# EAGLE design Gripper Control Board (EAGLE 9.6.2)
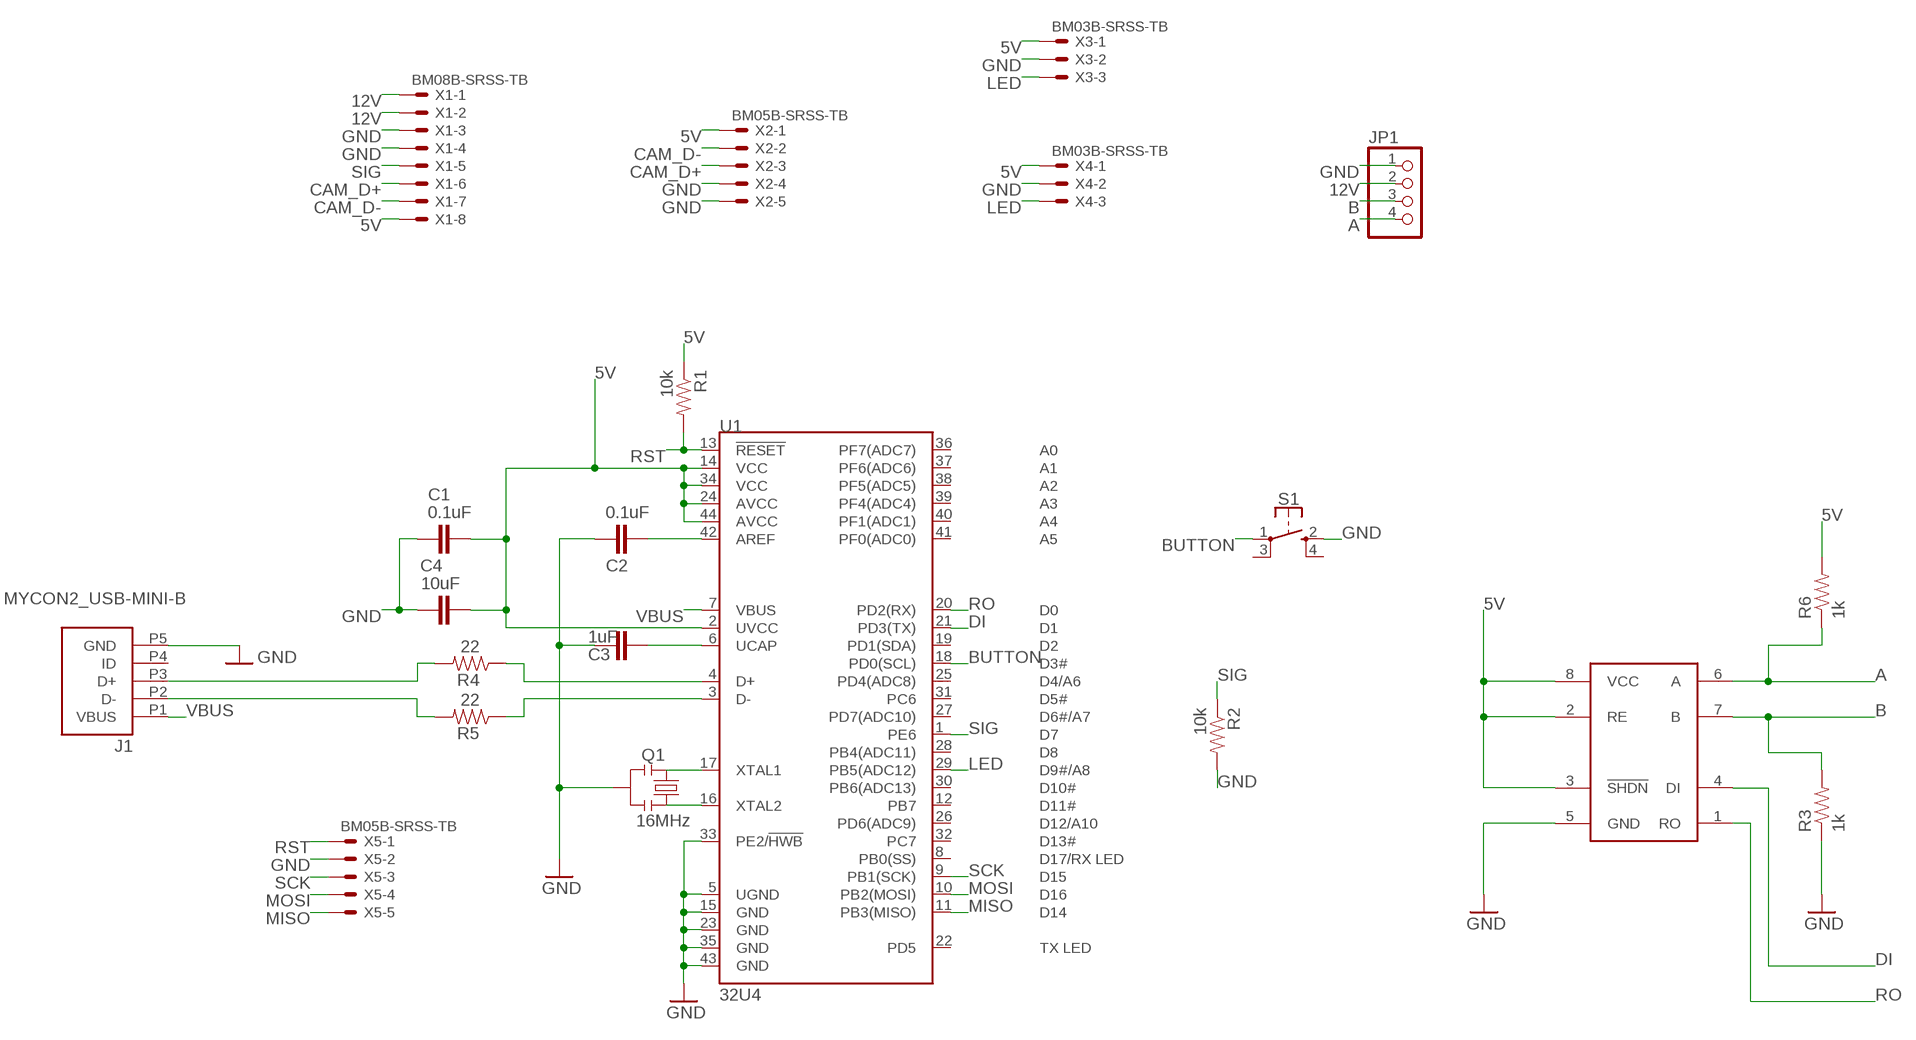
[diagram p0: schematic, sheet 1]

## Parts
C1  0.1uF  CAP0603-CAP  [0603-CAP]
C2  0.1uF  CAP0603-CAP  [0603-CAP]
C3  1uF  CAP0603-CAP  [0603-CAP]
C4  10uF  CAP0805  [0805]
J1  MYCON2_USB-MINI-B  [CON2_USB_MICRO_B_AT]
JP1  PINHD-1X4  [1X04]
Q1  16MHz  RESONATORSMD  [RESONATOR-SMD]
R1  10k  RESISTOR0603  [0603-RES]
R2  10k  RESISTOR0603  [0603-RES]
R3  1k  RESISTOR0603-RES  [0603-RES]
R4  22  RESISTOR0603  [0603-RES]
R5  22  RESISTOR0603  [0603-RES]
R6  1k  RESISTOR0603-RES  [0603-RES]
S1  SKSGAAE010  [SKSG]
U1  32U4  ATMEGA32U4QFN2  [QFN-44-NOPAD]
U2  MAX13487  MAX13487SOIC  [MAX13487]
X1  BM08B-SRSS-TB  [BM08B-SRSS-TB]
X2  BM05B-SRSS-TB  [BM05B-SRSS-TB]
X3  BM03B-SRSS-TB  [BM03B-SRSS-TB]
X4  BM03B-SRSS-TB  [BM03B-SRSS-TB]
X5  BM05B-SRSS-TB  [BM05B-SRSS-TB]

## Nets
5V [POWER]: C1.2 C4.2 R1.1 R6.2 U1.2(UVCC) U1.14(VCC) U1.24(AVCC) U1.34(VCC) U1.44(AVCC) U2.2(RE) U2.3(!SHDN) U2.8(VCC) X1.8 X2.1 X3.1 X4.1
12V [POWER]: JP1.2 X1.1 X1.2
A: JP1.4 R6.1 U2.6(A)
B: JP1.3 R3.2 U2.7(B)
BUTTON: S1.1 U1.18(PD0(SCL))
CAM_D+: X1.6 X2.3
CAM_D-: X1.7 X2.2
DI: U1.21(PD3(TX)) U2.4(DI)
GND: C1.1 C2.1 C3.1 C4.1 J1.P5(GND) JP1.1 Q1.2 R2.2 R3.1 S1.2 U1.5(UGND) U1.15(GND) U1.23(GND) U1.33(PE2/!HWB) U1.35(GND) U1.43(GND) U2.5(GND) X1.3 X1.4 X2.4 X2.5 X3.2 X4.2 X5.2
LED: U1.29(PB5(ADC12)) X3.3 X4.3
MISO: U1.11(PB3(MISO)) X5.5
MOSI: U1.10(PB2(MOSI)) X5.4
N$36: R4.1 U1.4(D+)
N$37: C3.2 U1.6(UCAP)
N$38: R5.1 U1.3(D-)
N$39: C2.2 U1.42(AREF)
N$40: J1.P3(D+) R4.2
N$41: J1.P2(D-) R5.2
RO: U1.20(PD2(RX)) U2.1(RO)
RST: R1.2 U1.13(!RESET) X5.1
SCK: U1.9(PB1(SCK)) X5.3
SIG: R2.1 U1.1(PE6) X1.5
VBUS: J1.P1(VBUS) U1.7(VBUS)
X1: Q1.1 U1.17(XTAL1)
X2: Q1.3 U1.16(XTAL2)
Unconnected: J1.P4(ID) S1.3 S1.4 U1.8(PB0(SS)) U1.12(PB7) U1.19(PD1(SDA)) U1.22(PD5) U1.25(PD4(ADC8)) U1.26(PD6(ADC9)) U1.27(PD7(ADC10)) U1.28(PB4(ADC11)) U1.30(PB6(ADC13)) U1.31(PC6) U1.32(PC7) U1.36(PF7(ADC7)) U1.37(PF6(ADC6)) U1.38(PF5(ADC5)) U1.39(PF4(ADC4)) U1.40(PF1(ADC1)) U1.41(PF0(ADC0))

## Library data of the parts
C1-C4 = SparkFun-Passives:CAP: Capacitor Standard 0603 ceramic capacitor, and 0.1" leaded capacitor.; PROD_ID: CAP-00868
J1 = SmartPrj:MYCON2_USB-MINI-B
JP1 = Anran_pinheader:PINHD-1X4: PIN HEADER
Q1 = Testing:RESONATOR: Resonator Small SMD resonator. This is the itty bitty 10/20MHz resonators with built in caps. CSTCE10M0G55 and CSTCE20M0V53. Footprint for SMD has been used in SFE production for years, and does work okay. 1:1 is an attempt to get larger fillets on the sides so it will be easier to inspect these solders in our AOI machine. The pads have been minimized to match the actual metal under the resonator. To see this relation, it includes an image import of the bottom side of the component. Imported to scale on layer 200.
R1 R2 R5 = SparkFun-Resistors:RESISTOR: Resistor Basic schematic elements and footprints for 0603, 1206, and PTH resistors.; PROD_ID: RES-08698
R3 R6 = SparkFun-Passives:RESISTOR: Resistor Basic schematic elements and footprints for 0603, 1206, and PTH resistors.
R4 = SparkFun-Resistors:RESISTOR: Resistor Basic schematic elements and footprints for 0603, 1206, and PTH resistors.; PROD_ID: RES-08698; SPICEPREFIX: R
S1 = SKSGAAE010:SKSGAAE010: Black Button Tactile Switch, SPST-NO 50 mA 0.4mm Surface Mount Source: Datasheet <http://uk.rs-online.com/web/p/products/9173829>; DESCRIPTION: Black Button Tactile Switch, SPST-NO 50 mA 0.4mm Surface Mount; HEIGHT: mm; MANUFACTURER_NAME: ALPS; MANUFACTURER_PART_NUMBER: SKSGAAE010; MOUSER_PART_NUMBER: 688-SKSGAAE010; MOUSER_PRICE-STOCK: https://www.mouser.com/Search/Refine.aspx?Keyword=688-SKSGAAE010
U1 = SparkFun-IC-Microcontroller:ATMEGA32U4: Atmel MCU, 32KByte Atmel 44-pin 8-bit Microcontroller with 32KBytes of ISP Flash and USB Controller Datasheet <http://cdn.sparkfun.com/datasheets/Dev/Arduino/Boards/ATMega32U4.pdf> SparkFun Products LilyPad Arduino USB - ATmega32U4 Board <https://www.sparkfun.com/products/12049> (DEV-12049) Pro Micro - 5V/16MHz <https://www.sparkfun.com/products/12640> (DEV-12640) Pro Micro - 3.3V/8MHz <https://www.sparkfun.com/products/12587> (DEV-12587) Fio v3 - ATmega32U4 <https://www.sparkfun.com/products/11520> (DEV-11520) Qduino Mini <https://www.sparkfun.com/products/13614> (DEV-13614) Makey Makey - Standard Kit <https://www.sparkfun.com/products/11511> (WIG-11511) Makey Makey Deluxe Kit <https://www.sparkfun.com/products/11519> (WIG-11519); PROD_ID: IC-10828
U2 = AET:MAX13487
X1 = con-jst2:?M08B-SRSS-TB: Disconnectable Crimp style connector, 1.0mm pitch 8 contacts
X2 X5 = con-jst2:?M05B-SRSS-TB: Disconnectable Crimp style connector, 1.0mm pitch 5 contacts
X3 X4 = con-jst2:?M03B-SRSS-TB: Disconnectable Crimp style connector, 1.0mm pitch 3 contacts

## Net classes
0 SIG: width 0.152 mm, drill 0.3 mm, clearance 0.152 mm
1 POWER: width 0.3 mm, drill 0.3 mm, clearance 0.152 mm
2 SERVO: width 0.5 mm, drill 0.3 mm, clearance 0.152 mm

## Board
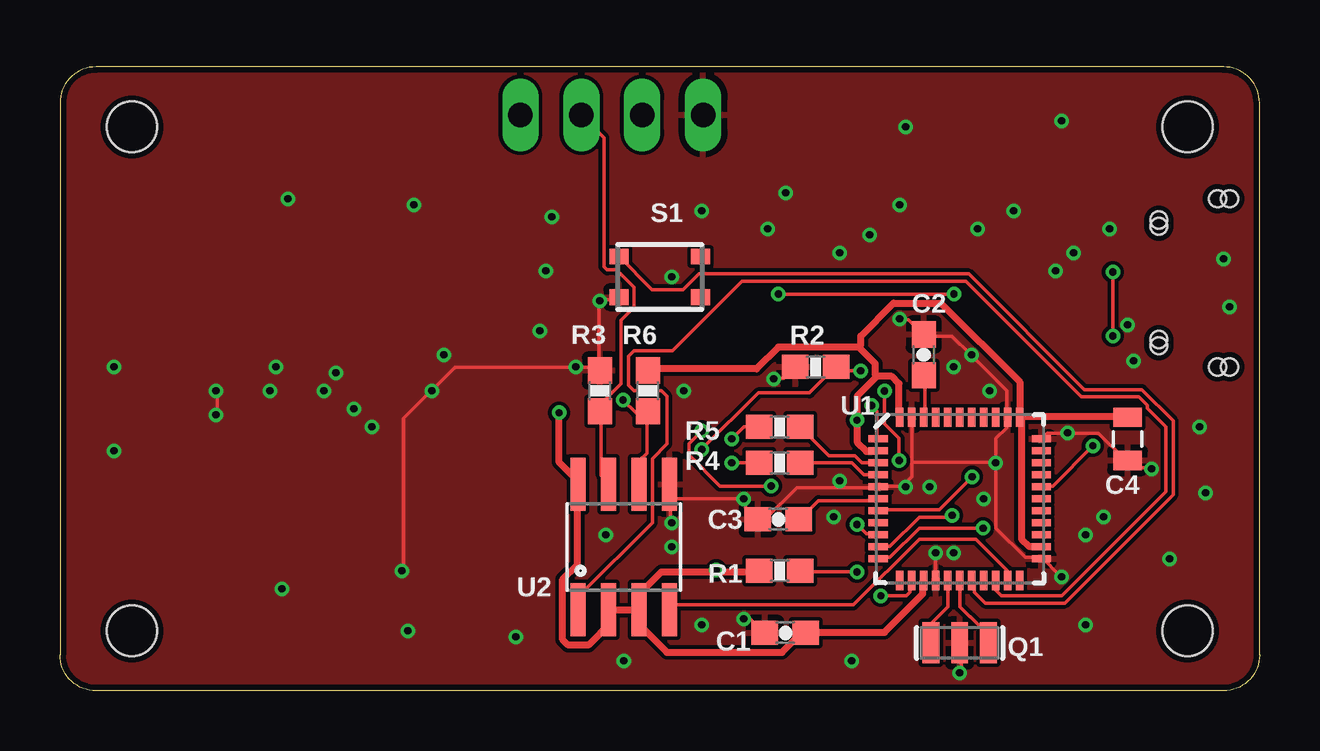
[diagram p1: board, top side]
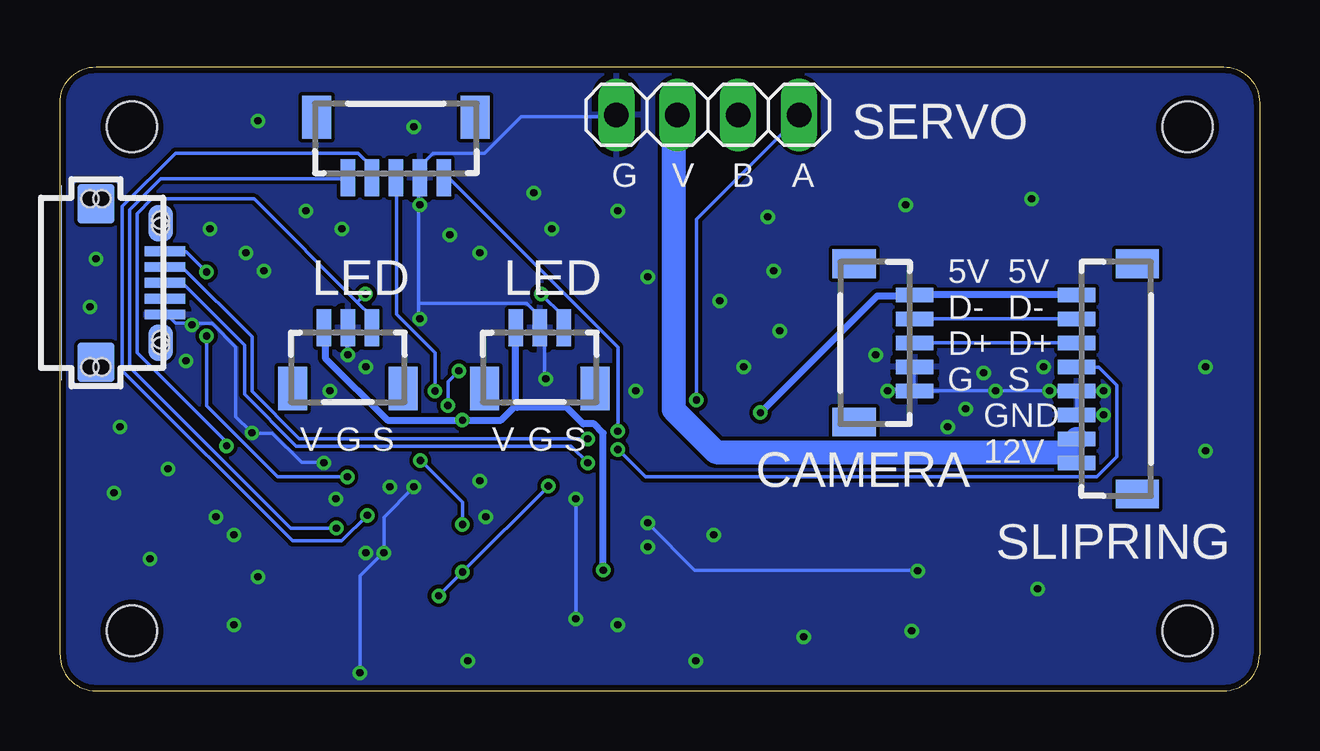
[diagram p2: board, bottom side, seen from below]

Size 50 x 26 mm. Coordinates in mm from the lower left corner, seen from the top.
Outline: 50,1.5 50,24.5 arc90 48.5,26 1.5,26 arc90 0,24.5 0,1.5 arc90 1.5,0 48.5,0 arc90 50,1.5
Copper layers (1*16): Top 0.035mm / dielectric 0.93mm / Bottom 0.035mm
Design rules "default *": minimum track width 6mil, minimum drill 0.3mm, track to track 6mil, track to pad 6mil, pad to pad 6mil, via to via 6mil, smd to smd 0mil, copper to edge 10mil, drill to drill 10mil, minimum pad ring 6mil, minimum via ring 6mil, stop-mask expansion 4mil, vias tented up to drill 0.3mm, thermal gap 10mil
Holes 2.1 mm at 3,23.5 47,23.5 3,2.5 47,2.5

### Footprints (pad centres in the part's own frame; a part is rotated, then mirrored left to right if it is on the bottom)
0603-CAP = smd 1.1 x 1: 1 -0.85,0; 2 0.85,0
0805 = smd 0.8 x 1.2: 1 -0.9,0; 2 0.9,0
CON2_USB_MICRO_B_AT = smd 0.406 x 1.727: P1 -1.321,2.87; P2 -0.66,2.87; P3 0,2.87; P4 0.66,2.87; P5 1.321,2.87 | smd 1.651 x 1.549: S1 -3.302,0; S2 3.302,0 | smd 1.524 x 1.016: S3 -2.489,2.692; S4 2.489,2.692 | hole 0.7: -3.505,0.254; -3.505,-0.254; 3.505,0.254; 3.505,-0.254; -2.616,2.692; -2.362,2.692; 2.362,2.692; 2.616,2.692
1X04 = drill 1.016 long: 1 -3.81,0; 2 -1.27,0; 3 1.27,0; 4 3.81,0
RESONATOR-SMD = smd 0.7 x 1.7: 1 -1.2,0; 2 0,0; 3 1.2,0
0603-RES = smd 1.1 x 1: 1 -0.85,0; 2 0.85,0
SKSG = smd 0.8 x 0.65: 1 -1.7,0.85; 2 -1.7,-0.85; 3 1.7,0.85; 4 1.7,-0.85
QFN-44-NOPAD = smd 0.8 x 0.3: 1 -3.4,2.5; 2 -3.4,2; 3 -3.4,1.5; 4 -3.4,1; 5 -3.4,0.5; 6 -3.4,0; 7 -3.4,-0.5; 8 -3.4,-1; 9 -3.4,-1.5; 10 -3.4,-2; 11 -3.4,-2.5; 23 3.4,-2.5; 24 3.4,-2; 25 3.4,-1.5; 26 3.4,-1; 27 3.4,-0.5; 28 3.4,0; 29 3.4,0.5; 30 3.4,1; 31 3.4,1.5; 32 3.4,2; 33 3.4,2.5 | smd 0.3 x 0.8: 12 -2.5,-3.4; 13 -2,-3.4; 14 -1.5,-3.4; 15 -1,-3.4; 16 -0.5,-3.4; 17 0,-3.4; 18 0.5,-3.4; 19 1,-3.4; 20 1.5,-3.4; 21 2,-3.4; 22 2.5,-3.4; 34 2.5,3.4; 35 2,3.4; 36 1.5,3.4; 37 1,3.4; 38 0.5,3.4; 39 0,3.4; 40 -0.5,3.4; 41 -1,3.4; 42 -1.5,3.4; 43 -2,3.4; 44 -2.5,3.4
MAX13487 = smd 0.61 x 2.21: 1 -1.905,-2.616; 2 -0.635,-2.616; 3 0.635,-2.616; 4 1.905,-2.616; 5 1.905,2.616; 6 0.635,2.616; 7 -0.635,2.616; 8 -1.905,2.616
BM08B-SRSS-TB = smd 0.6 x 1.55: 1 3.5,-1.625; 2 2.5,-1.625; 3 1.5,-1.625; 4 0.5,-1.625; 5 -0.5,-1.625; 6 -1.5,-1.625; 7 -2.5,-1.625; 8 -3.5,-1.625 | smd 1.2 x 1.8: FIT@1 4.8,0.9; FIT@2 -4.8,0.9
BM05B-SRSS-TB = smd 0.6 x 1.55: 1 2,-1.625; 2 1,-1.625; 3 0,-1.625; 4 -1,-1.625; 5 -2,-1.625 | smd 1.2 x 1.8: FIT@1 3.3,0.9; FIT@2 -3.3,0.9
BM03B-SRSS-TB = smd 0.6 x 1.55: 1 1,-1.625; 2 0,-1.625; 3 -1,-1.625 | smd 1.2 x 1.8: FIT@1 2.3,0.9; FIT@2 -2.3,0.9

### Placement (x,y rotation side)
C1  30.23,2.42 0 top
C2  36,14 270 top
C3  29.94,7.15 0 top
C4  44.5,10.5 90 top
J1  48.5,17 270 bottom
JP1  23,24 0 bottom
Q1  37.5,2 180 top
R1  30,5 0 top
R2  31.5,13.5 180 top
R3  22.5,12.5 270 top
R4  30,9.5 180 top
R5  30,11 180 top
R6  24.5,12.5 90 top
S1  25,17.25 0 top
U1  37.5,8 0 top
U2  23.5,6 0 top
X1  6,13 270 bottom
X2  16,14.5 90 bottom
X3  30,13.5 180 bottom
X4  38,13.5 180 bottom
X5  36,23 0 bottom

### Tracks (layer width: path | path; a pad name or v marks a point on that pad's centre or on a via)
5V  (via drill 0.3)
  Top 0.3: U1.34 40.01,11.43 44.42,11.43 C4.2 | U1.24 40.84,6.02 40.39,6.02 40.08,6.33 40.08,11.28 U1.34 | 34.06,13.11 33.22,12.27 v33.22,11.28 33.22,10.36 33.6,9.98 34.06,9.98 U1.2 | 34.06,13.11 34.67,13.11 34.98,12.8 34.98,11.43 U1.44 | 33.3,14.33 29.95,14.33 29.03,13.41 24.54,13.41 R6.2 | 33.3,14.33 33.98,13.64 33.98,13.18 34.06,13.11 | U1.34 40.01,11.51 40.01,12.88 36.73,16.15 34.75,16.15 33.38,14.78 33.38,14.4 33.3,14.33 | U1.14 35.97,4.57 35.97,4.04 34.37,2.44 31.09,2.44 C1.2 30.94,2.44 30.1,1.6 25.3,1.6 24.23,2.67 24.23,3.28 U2.3 | 27.36,4.95 25.07,4.95 24.16,4.04 24.16,3.43 U2.3 | 27.36,4.95 29.11,4.95 R1.1 | U2.3 24,3.35 22.94,3.35 U2.2 22.94,3.2 22.94,2.82 22.02,1.91 21.18,1.91 20.95,2.13 20.95,4.65 21.57,5.26 21.57,8.61 U2.8 21.57,8.76 20.8,9.53 v20.8,11.59 | v27.36,5.03 27.36,4.95
  Bottom 0.3: X1.8 X2.1 14.42,16.46 15.94,16.46 v20.8,11.59 | 31.01,11.89 31.01,15.09 X3.1 | 31.01,11.89 31.62,11.28 v33.22,11.28 36.35,11.28 38.94,13.87 38.94,15.09 X4.1 | v27.36,5.03 27.36,10.74 27.74,11.12 28.19,11.12 28.88,11.81 30.94,11.81 31.01,11.89
12V
  Bottom 0.3: JP1.2 24.23,23.93 | X1.2 7.62,10.21
  Bottom 0.5: 7.62,10.21 X1.1
  Bottom 1: X1.2 8.18,9.95 22.65,9.95 24.42,11.72 24.42,23.73 24.23,23.93
A  (via drill 0.3)
  Top 0.152: U2.6 24.16,8.69 24.16,9.6 24.46,9.91 24.46,11.58 R6.1 24.38,11.58 24,11.58 v23.47,12.12
  Bottom 0.152: v23.47,12.12 23.47,19.66 19.2,23.93 JP1.4
B
  Top 0.152: U2.7 22.86,8.69 22.55,8.99 22.55,11.58 R3.2 22.55,11.66 22.55,11.96 23.3,12.7 23.39,12.8 23.39,15.45 23.93,15.98 23.93,16.82 23.2,17.55 22.8,17.55 22.67,17.68 22.67,23.05 21.79,23.93 JP1.3
BUTTON
  Top 0.152: U1.18 38.12,4.48 38.12,4.11 38.57,3.66 41.88,3.66 46.41,8.18 46.41,11.25 45.1,12.55 42.7,12.55 37.88,17.37 26.62,17.37 25.97,16.72 24.68,16.72 S1.1
CAM_D+
  Bottom 0.152: X1.6 X2.3
CAM_D-
  Bottom 0.152: X1.7 X2.2
DI
  Top 0.152: U1.21 39.47,4.65 39.47,5.03 38.18,6.33 35.81,6.33 33.07,3.58 25.6,3.58 25.45,3.43 U2.4
GND  (via drill 0.3)
  Top 0.152: S1.2 23.24,16.38 23.16,16.31 22.55,16.31 v22.5,16.25 22.48,16.23 22.48,13.49 R3.1 22.48,13.41 22.4,13.49 21.57,13.49 v21.5,13.5 21.49,13.49 16.46,13.49 15.54,12.57 v15.5,12.5 15.47,12.5 14.33,11.35 14.33,5.03 v14.25,5 | v6.5,11.5 6.55,11.51 6.55,12.5 v6.5,12.5 | v28.5,3 28.57,2.97 28.8,2.97 29.34,2.44 C1.1 | 25.45,8 25.45,8.61 U2.5 25.45,8 | 25.45,8 25.45,7.01 v25.5,7 | 25.45,8 v28.5,8 28.57,7.92 28.57,7.62 29.03,7.16 C3.1 29.11,7.16 29.41,7.16 30.71,8.46 34.06,8.46 U1.5 34.14,8.53 35.2,8.53 v35.25,8.5 35.2,8.61 35.51,8.91 35.51,9.53 | v37.5,0.75 37.57,0.76 37.57,1.98 Q1.2 | v36.5,5.75 36.5,5.71 36.5,4.65 U1.15 | 35.51,9.53 35.51,11.35 U1.43 | U1.33 40.92,10.52 41.15,10.74 41.99,10.74 v42,10.75 42.06,10.74 43.28,10.74 44.42,9.6 C4.1 44.5,9.53 44.73,9.3 45.49,9.3 v45.5,9.25 | v41.75,4.75 41.68,4.8 40.92,5.56 U1.23 40.84,5.56 40.23,5.56 39.01,6.78 39.01,9.45 v39,9.5 | v39,9.5 39.01,9.53 39.01,10.52 39.47,10.97 39.47,11.35 U1.35 39.47,11.43 39.47,12.5 38.02,13.95 v38,14 37.95,14.02 37.19,14.78 36.04,14.78 C2.1 35.97,14.86 35.36,15.47 35.05,15.47 v35,15.5 | v29.75,13 29.79,13.03 30.18,13.03 30.63,13.49 R2.2 | 35.51,9.53 38.94,9.53 v39,9.5
  Bottom 0.152: X1.4 7.7,12.5 8.69,12.5 v8.75,12.5 8.76,12.5 14.33,12.5 X2.5 | v6.5,12.5 6.55,12.5 X1.4 | X1.3 7.62,12.42 X1.4 | X2.5 14.4,12.57 14.4,13.49 X2.4 | X2.5 14.48,12.57 15.47,12.57 v15.5,12.5 | v28.5,3 28.5,3.05 28.5,7.92 v28.5,8 | v35.25,8.5 35.28,8.46 36.5,7.24 36.5,5.79 v36.5,5.75 36.58,5.71 37.49,4.8 37.49,0.76 v37.5,0.75 | J1.P5 45.57,15.7 45.19,15.32 44.5,15.32 v44.5,15.25 44.42,15.32 43.66,15.32 42.67,14.33 42.67,11.43 42.06,10.82 v42,10.75 41.99,10.74 41.15,10.74 39.93,9.53 39.01,9.53 v39,9.5 | v29.75,13 29.79,13.03 29.79,14.94 29.95,15.09 X3.2 30.02,15.16 30.02,15.62 30.56,16.15 35.05,16.15 | v38,14 38.02,14.02 38.02,15.09 X4.2 | 35.05,16.15 35.05,15.54 v35,15.5 | 35.05,16.15 35.05,20.19 v35,20.25 35.05,20.27 35.05,21.34 X5.2 34.98,21.41 34.98,21.87 34.44,22.4 32.31,22.4 30.79,23.93 26.82,23.93 JP1.1 | v14.25,5 14.33,5.03 23.55,5.03 25.45,6.93 v25.5,7
  other vias: 9.25,4.25 14.5,2.5 13,11 9.5,20.5 14.75,20.25 20.25,17.5 2.25,13.5 2.25,10 22.75,6.5 25.5,6 26.75,2.75 23.5,1.25 19,2.25 33,1.25 42.75,2.75 46.25,5.5 43.5,7.25 42.75,6.5 47.75,8.25 47.5,11 36.25,8.5 38.5,8 38.75,12.5 37.25,13.5 38.25,19.25 33.75,19 30.25,20.75 32.5,18.25 29.5,19.25 42.25,18.25 41.5,17.5 43.75,19.25 39.75,20 35.25,23.5 41.75,23.75 48.5,18 48.75,16 26,12.5 32.25,7.25 32.5,8.75 20,15 25.5,17.25 26.75,20 20.5,19.75 11.5,13.25 16,14 37.25,5.75 44.75,13.75 12.25,11.75 9,13.5 11,12.5
  pour Top: -1,27 51,27 51,-1 -1,-1
  pour Bottom: -2,28 52,28 52,-2 -2,-2
LED  (via drill 0.3)
  Top 0.152: v43.05,10.21 41.38,8.53 40.92,8.53 U1.29 | v37.26,16.54 v29.95,16.54
  Bottom 0.152: v43.05,10.21 43.05,10.36 46.79,14.1 46.79,19.89 46.18,20.5 41.91,20.5 37.6,16.19 | 37.6,16.19 37.03,15.62 37.03,15.16 X4.3 | v29.95,16.54 29.03,15.62 29.03,15.16 X3.3 | 37.6,16.19 v37.26,16.54
MISO  (via drill 0.3)
  Top 0.152: v38.48,6.78 35.81,6.78 34.59,5.56 34.14,5.56 U1.11
  Bottom 0.152: v38.48,6.78 40.39,6.78 47.09,13.49 47.09,20.04 45.8,21.34 38.02,21.34 X5.5
MOSI  (via drill 0.3)
  Top 0.152: v37.19,7.32 37.11,7.24 35.81,7.24 34.59,6.02 34.14,6.02 U1.10
  Bottom 0.152: v37.19,7.32 38.25,6.25 40.31,6.25 47.4,13.34 47.4,20.19 45.19,22.4 37.57,22.4 37.03,21.87 37.03,21.41 X5.4
N$36
  Top 0.152: U1.4 33.5,9 33,9.5 R4.1
N$37
  Top 0.152: U1.6 34.06,7.92 31.62,7.92 30.86,7.16 C3.2
N$38
  Top 0.152: U1.3 33.43,9.5 33.13,9.8 32.05,9.8 R5.1
N$39
  Top 0.152: U1.42 36.04,11.43 36.04,13.11 C2.2
N$40  (via drill 0.3)
  Top 0.152: R4.2 v28,9.5
  Bottom 0.152: v28,9.5 28.7,10.2 40.15,10.2 42.3,12.35 42.3,14.39 44.91,17 J1.P3
N$41  (via drill 0.3)
  Top 0.152: R5.2 28.5,11 v28,10.5
  Bottom 0.152: v28,10.5 40.02,10.5 42,12.48 42,14.75 44.91,17.66 J1.P2
RO
  Top 0.152: U1.20 39.01,4.57 39.01,4.19 39.24,3.96 41.76,3.96 46.1,8.31 46.1,11 45.33,11.77 45.33,11.89 44.97,12.25 42.57,12.25 37.75,17.07 28.42,17.07 25.53,14.17 23.93,14.17 23.7,13.95 23.7,12.72 23.93,12.5 25.07,12.5 25.3,12.27 25.3,10.29 24.69,9.68 24.69,7.01 21.64,3.96 21.64,3.43 U2.1
RST  (via drill 0.3)
  Top 0.152: v34.21,3.96 35.28,3.96 35.43,4.12 35.43,4.57 U1.13 | v33.22,4.95 30.86,4.95 R1.2 | v26.75,10.82 26.21,10.29 26.21,9.83 27.51,8.53 v29.64,8.53
  Bottom 0.152: v34.21,3.96 v33.22,4.95 v29.64,8.53 | v26.75,10.82 26.75,14.33 33.76,21.34 33.98,21.34 X5.1
SCK  (via drill 0.3)
  Top 0.152: v33.22,6.93 33.6,6.55 34.06,6.55 U1.9 | v34.98,9.6 34.98,10.52 34.37,11.12 v34.37,12.5
  Bottom 0.152: v33.22,6.93 33.22,7.85 v34.98,9.6 | v34.37,12.5 34.37,14.1 35.97,15.7 35.97,21.34 X5.3
SIG  (via drill 0.3)
  Top 0.152: v33.83,11.89 34.06,11.66 34.06,10.52 U1.1 | v33.38,13.34 32.54,13.34 32.38,13.49 R2.1 32.31,13.49 31.24,12.42 29.11,12.42 v26.75,10.06
  Bottom 0.152: v33.83,11.89 33.83,12.88 v33.38,13.34 | v26.75,10.06 25.6,8.91 6.78,8.91 5.94,9.75 5.94,12.72 6.71,13.49 7.62,13.49 X1.5
VBUS  (via drill 0.3)
  Top 0.152: v38.02,8.91 36.65,7.54 34.14,7.54 U1.7 | v43.89,17.45 v43.89,14.78
  Bottom 0.152: v38.02,8.91 40.92,8.91 43.89,11.89 v43.89,14.78 | v43.89,17.45 44.73,18.29 45.57,18.29 J1.P1
X1
  Top 0.152: Q1.1 38.7,2.32 37.95,3.08 37.92,3.08 37.5,3.5 U1.17
X2
  Top 0.152: Q1.3 36.3,2.8 37,3.5 U1.16

### Text on the board
bPlace: SERVO | A | B | V | G | 5V | 5V | D- | D- | LED | LED | D+ | D+ | S | G | GND | 12V | S | G | V | S | G | V | CAMERA | SLIPRING